# EAGLE schematic Down Linker IM (EAGLE 9.6.2)
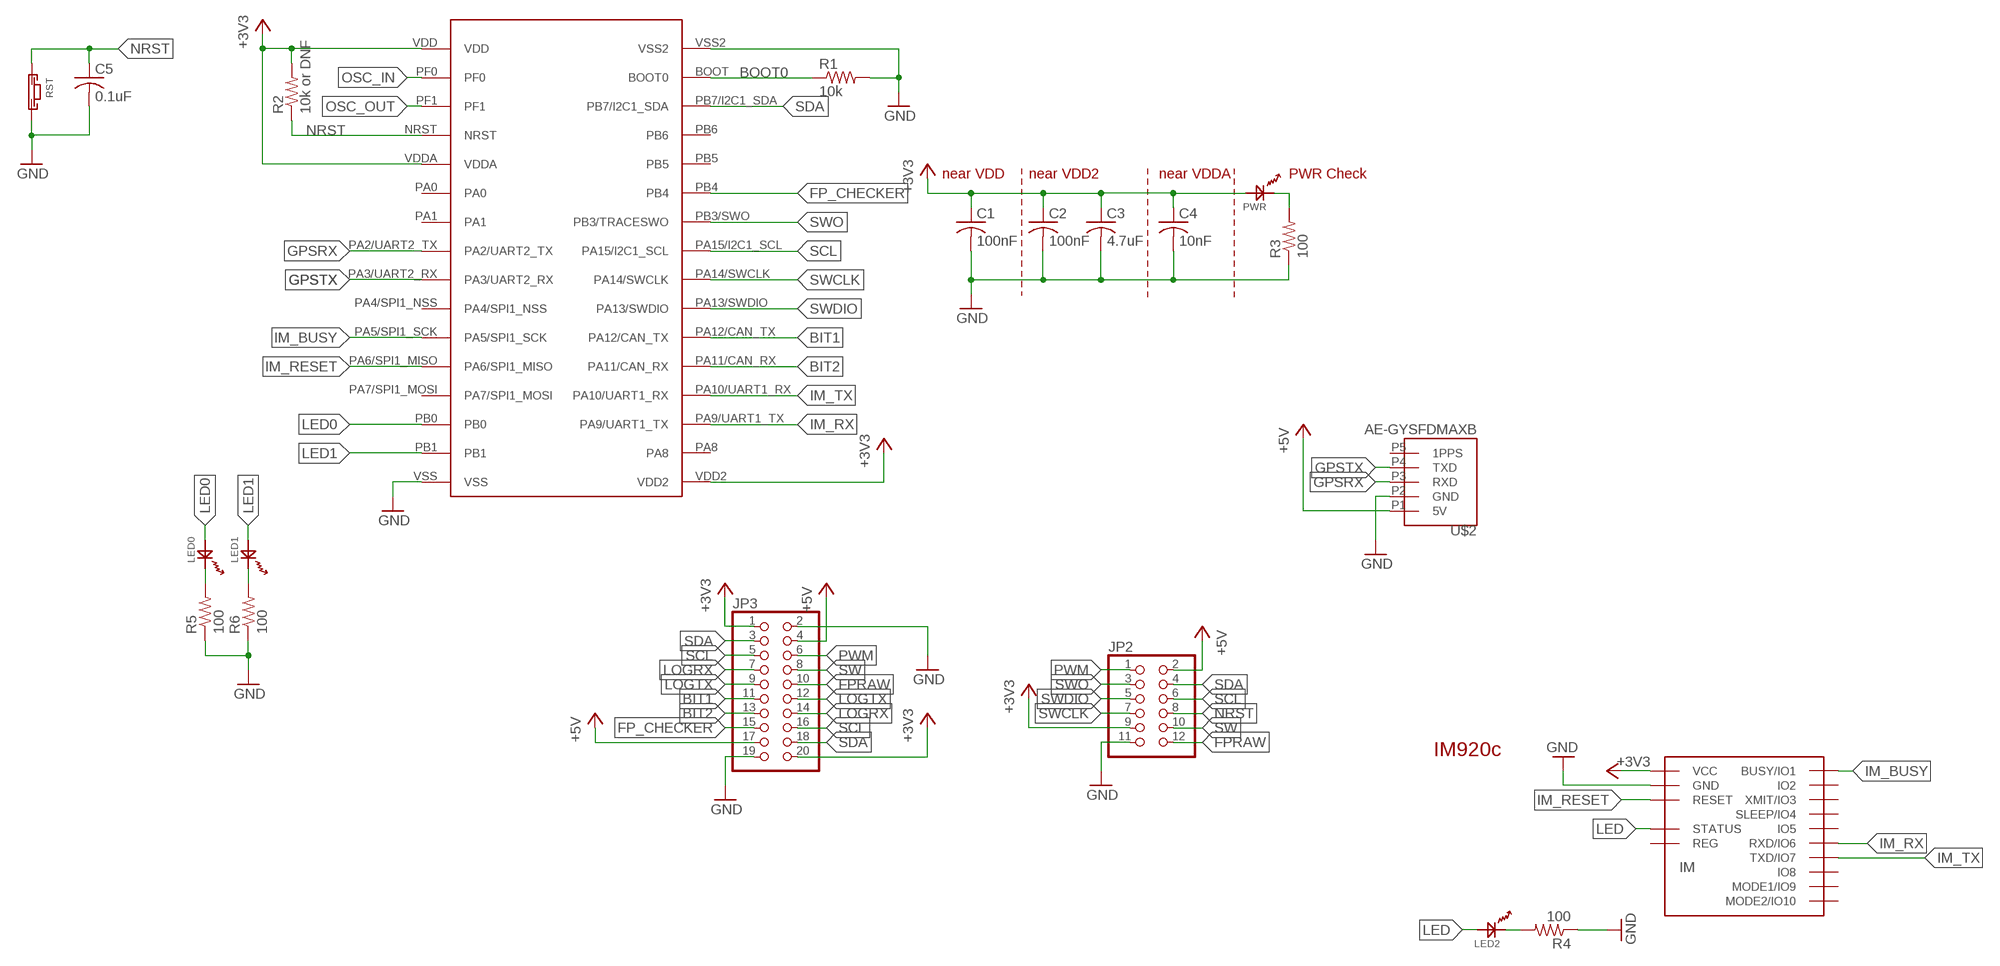
[diagram p0: schematic, sheet 1]

## Parts
C1  100nF  C-USC1608  [C1608]
C2  100nF  C-USC1608  [C1608]
C3  4.7uF  C-USC1608  [C1608]
C4  10nF  C-USC1608  [C1608]
C5  0.1uF  C-USC1608  [C1608]
IM  IM920C  [IM920C]
JP2  PINHD-2X6/90  [2X06/90]
JP3  PINHD-2X10/90  [2X10/90]
LED0  OSXX1608C1A  [OSXX1608C1A]
LED1  OSXX1608C1A  [OSXX1608C1A]
LED2  OSXX1608C1A  [OSXX1608C1A]
PWR  OSXX1608C1A  [OSXX1608C1A]
R1  10k  R-US_R0603  [R0603]
R2  10k or DNF  R-US_R0603  [R0603]
R3  100  R-US_R0603  [R0603]
R4  100  R-US_R0603  [R0603]
R5  100  R-US_R0603  [R0603]
R6  100  R-US_R0603  [R0603]
RST  TVAF06-A020B-R  [TVAF06-A020B-R]
U$1  STM32F303K8  [STM32F303K8]
U$2  AE-GYSFDMAXB  [AE-GYSFDMAXB]

## Nets
+3V3: C1.1 C2.1 C3.1 C4.1 IM.$P17(VCC) JP2.9 JP3.1 JP3.20 PWR.AN R2.2 U$1.VDD U$1.VDD2 U$1.VDDA
+5V: JP2.2 JP3.4 JP3.17 U$2.P1(5V)
BIT1: JP3.11 U$1.PA12/CAN_TX
BIT2: JP3.13 U$1.PA11/CAN_RX
BOOT0: R1.1 U$1.BOOT(BOOT0)
FP_CHECKER: JP3.15 U$1.PB4
FPRAW: JP2.12 JP3.10
GND: C1.2 C2.2 C3.2 C4.2 C5.2 IM.$P18(GND) JP2.11 JP3.2 JP3.19 R1.2 R3.1 R4.1 R5.1 R6.1 RST.P$2 U$1.VSS U$1.VSS2 U$2.P2(GND)
GPSRX: U$1.PA2/UART2_TX U$2.P3(RXD)
GPSTX: U$1.PA3/UART2_RX U$2.P4(TXD)
IM_BUSY: IM.$P1(BUSY/IO1) U$1.PA5/SPI1_SCK
IM_RESET: IM.$P19(RESET) U$1.PA6/SPI1_MISO
IM_RX: IM.$P6(RXD/IO6) U$1.PA9/UART1_TX
IM_TX: IM.$P7(TXD/IO7) U$1.PA10/UART1_RX
LED: IM.$P15(STATUS) LED2.AN
LED0: LED0.AN U$1.PB0
LED1: LED1.AN U$1.PB1
LOGRX: JP3.7 JP3.14
LOGTX: JP3.9 JP3.12
N$1: PWR.CT R3.2
N$2: LED0.CT R5.2
N$3: LED2.CT R4.2
N$4: LED1.CT R6.2
NRST: C5.1 JP2.8 R2.1 RST.P$1 U$1.NRST
OSC_IN: U$1.PF0
OSC_OUT: U$1.PF1
PWM: JP2.1 JP3.6
SCL: JP2.6 JP3.5 JP3.16 U$1.PA15/I2C1_SCL
SDA: JP2.4 JP3.3 JP3.18 U$1.PB7/I2C1_SDA
SW: JP2.10 JP3.8
SWCLK: JP2.7 U$1.PA14/SWCLK
SWDIO: JP2.5 U$1.PA13/SWDIO
SWO: JP2.3 U$1.PB3/SWO(PB3/TRACESWO)
Unconnected: IM.$P2(IO2) IM.$P3(XMIT/IO3) IM.$P4(SLEEP/IO4) IM.$P5(IO5) IM.$P8(IO8) IM.$P9(MODE1/IO9) IM.$P10(MODE2/IO10) IM.$P16(REG) U$1.PA0 U$1.PA1 U$1.PA4/SPI1_NSS U$1.PA7/SPI1_MOSI U$1.PA8 U$1.PB5 U$1.PB6 U$2.P5(1PPS)

## Notes on the sheet
- near VDD | near VDD2 | near VDDA | PWR Check
- IM920c

## Library data of the parts
C1-C5 = rcl:C-US: CAPACITOR, American symbol; SPICEPREFIX: C
IM = IM920:IM920C
JP2 = pinhead:PINHD-2X6: PIN HEADER
JP3 = pinhead:PINHD-2X10: PIN HEADER
LED0 LED1 LED2 PWR = Chip LED:OSXX1608C1A
R1-R6 = rcl:R-US_: RESISTOR, American symbol; SPICEPREFIX: R
RST = Tact switch:TVAF06-A020B-R
U$1 = STM32F303K8:STM32F303K8
U$2 = AE-GYSFDMAXB:AE-GYSFDMAXB